# EAGLE schematic FlashPanelV6_0 (EAGLE 7.3.0)
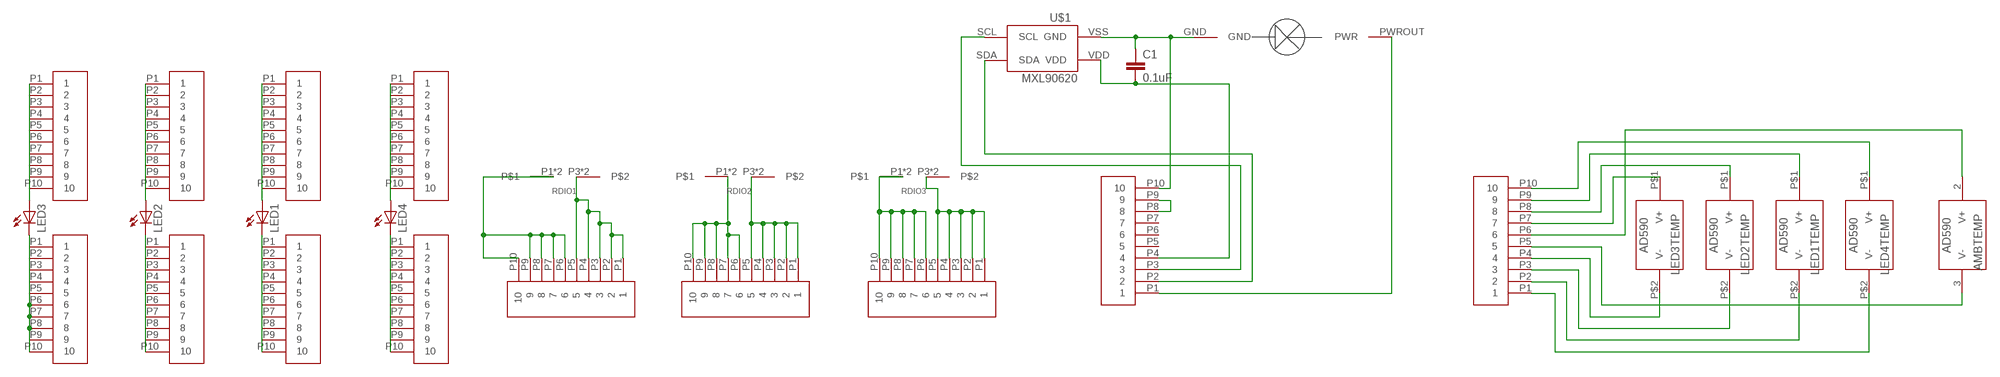
[diagram p0: schematic, sheet 1]

## Parts
AMBTEMP  AD590  AD590-SOIC-8  [8SOIC]
ANTDEP1M  10PINMALE  [10PINMALE]
ANTDEP2M  10PINMALE  [10PINMALE]
ANTDEP3M  10PINMALE  [10PINMALE]
C1  0.1uF  CAP0805  [0805]
CONN13M  10PINMALE  [10PINMALE]
LED1  CXM27  [CXM27]
LED1+M  10PINMALE  [10PINMALE]
LED1-M  10PINMALE  [10PINMALE]
LED1TEMP  AD590-TH  [AD590TH]
LED2  CXM27  [CXM27]
LED2+M  10PINMALE  [10PINMALE]
LED2-M  10PINMALE  [10PINMALE]
LED2TEMP  AD590-TH  [AD590TH]
LED3  CXM27  [CXM27]
LED3+M  10PINMALE  [10PINMALE]
LED3-M  10PINMALE  [10PINMALE]
LED3TEMP  AD590-TH  [AD590TH]
LED4  CXM27  [CXM27]
LED4+M  10PINMALE  [10PINMALE]
LED4-M  10PINMALE  [10PINMALE]
LED4TEMP  AD590-TH  [AD590TH]
RDIO1  RDIO  [RDIO_DPLY]
RDIO2  RDIO  [RDIO_DPLY]
RDIO3  RDIO  [RDIO_DPLY]
TEMPCONNM  10PINMALE  [10PINMALE]
U$1  MXL90620  [MXL90620]
U$2  PHOTODETECTBOTTOM  [PHOTODETECTBOTTOM]

## Nets
3V3: C1.2 CONN13M.P4 U$1.VDD
GND: C1.1 CONN13M.P10 U$1.VSS(GND) U$2.GND
N$1: LED3+M.P1 LED3+M.P2 LED3+M.P3 LED3+M.P4 LED3+M.P5 LED3+M.P6 LED3+M.P7 LED3+M.P8 LED3+M.P9 LED3+M.P10 LED3.ANODE(A)
N$2: LED3-M.P1 LED3-M.P2 LED3-M.P3 LED3-M.P4 LED3-M.P5 LED3-M.P6 LED3-M.P7 LED3-M.P8 LED3-M.P9 LED3-M.P10 LED3.CATHODE(C)
N$3: LED2+M.P1 LED2+M.P2 LED2+M.P3 LED2+M.P4 LED2+M.P5 LED2+M.P6 LED2+M.P7 LED2+M.P8 LED2+M.P9 LED2+M.P10 LED2.CATHODE(C)
N$4: LED2-M.P1 LED2-M.P2 LED2-M.P3 LED2-M.P4 LED2-M.P5 LED2-M.P6 LED2-M.P7 LED2-M.P8 LED2-M.P9 LED2-M.P10 LED2.ANODE(A)
N$5: LED1+M.P1 LED1+M.P2 LED1+M.P3 LED1+M.P4 LED1+M.P5 LED1+M.P6 LED1+M.P7 LED1+M.P8 LED1+M.P9 LED1+M.P10 LED1.CATHODE(C)
N$6: LED1-M.P1 LED1-M.P2 LED1-M.P3 LED1-M.P4 LED1-M.P5 LED1-M.P6 LED1-M.P7 LED1-M.P8 LED1-M.P9 LED1-M.P10 LED1.ANODE(A)
N$7: LED4-M.P1 LED4-M.P2 LED4-M.P3 LED4-M.P4 LED4-M.P5 LED4-M.P6 LED4-M.P7 LED4-M.P8 LED4-M.P9 LED4-M.P10 LED4.CATHODE(C)
N$8: LED4+M.P1 LED4+M.P2 LED4+M.P3 LED4+M.P4 LED4+M.P5 LED4+M.P6 LED4+M.P7 LED4+M.P8 LED4+M.P9 LED4+M.P10 LED4.ANODE(A)
N$10: ANTDEP1M.P1 ANTDEP1M.P2 ANTDEP1M.P3 ANTDEP1M.P4 ANTDEP1M.P5 RDIO1.P3 RDIO1.P4
N$11: ANTDEP2M.P6 ANTDEP2M.P7 ANTDEP2M.P8 ANTDEP2M.P9 ANTDEP2M.P10 RDIO2.P1 RDIO2.P2
N$12: ANTDEP2M.P1 ANTDEP2M.P2 ANTDEP2M.P3 ANTDEP2M.P4 ANTDEP2M.P5 RDIO2.P3 RDIO2.P4
N$13: ANTDEP3M.P6 ANTDEP3M.P7 ANTDEP3M.P8 ANTDEP3M.P9 ANTDEP3M.P10 RDIO3.P1 RDIO3.P2
N$14: ANTDEP3M.P1 ANTDEP3M.P2 ANTDEP3M.P3 ANTDEP3M.P4 ANTDEP3M.P5 RDIO3.P3 RDIO3.P4
N$15: LED4TEMP.P$2(V-) TEMPCONNM.P1
N$16: LED1TEMP.P$2(V-) TEMPCONNM.P2
N$20: LED2TEMP.P$2(V-) TEMPCONNM.P3
N$21: LED3TEMP.P$2(V-) TEMPCONNM.P4
N$22: LED4TEMP.P$1(V+) TEMPCONNM.P10
N$23: LED1TEMP.P$1(V+) TEMPCONNM.P9
N$24: LED2TEMP.P$1(V+) TEMPCONNM.P8
N$25: LED3TEMP.P$1(V+) TEMPCONNM.P7
N$26: AMBTEMP.3(V-) TEMPCONNM.P5
N$27: AMBTEMP.2(V+) TEMPCONNM.P6
PDOUT: CONN13M.P1 U$2.PWROUT(PWR)
RDIO1: ANTDEP1M.P6 ANTDEP1M.P7 ANTDEP1M.P8 ANTDEP1M.P9 ANTDEP1M.P10 RDIO1.P1 RDIO1.P2
SCL: CONN13M.P3 U$1.SCL
SDA: CONN13M.P2 U$1.SDA
TEST: CONN13M.P8 CONN13M.P9
Unconnected: CONN13M.P5 CONN13M.P6 CONN13M.P7

## Library data of the parts
AMBTEMP = CNTRL_BOARD:AD590-SOIC-8
ANTDEP1M ANTDEP2M ANTDEP3M CONN13M LED1+M LED1-M LED2+M LED2-M LED3+M LED3-M LED4+M LED4-M TEMPCONNM = cxm27:10PINMALE
C1 = CNTRL_BOARD:CAP: Capacitor Standard 0603 ceramic capacitor, and 0.1" leaded capacitor.
LED1-LED4 = cxm27:CXM27
LED1TEMP LED2TEMP LED3TEMP LED4TEMP = CNTRL_BOARD:AD590-TH
RDIO1-RDIO3 = rdio_deploy:RDIO
U$1 = CNTRL_BOARD:MXL90620
U$2 = solarcellnew:PHOTODETECTBOTTOM